# Altium project new_board.PrjPCB
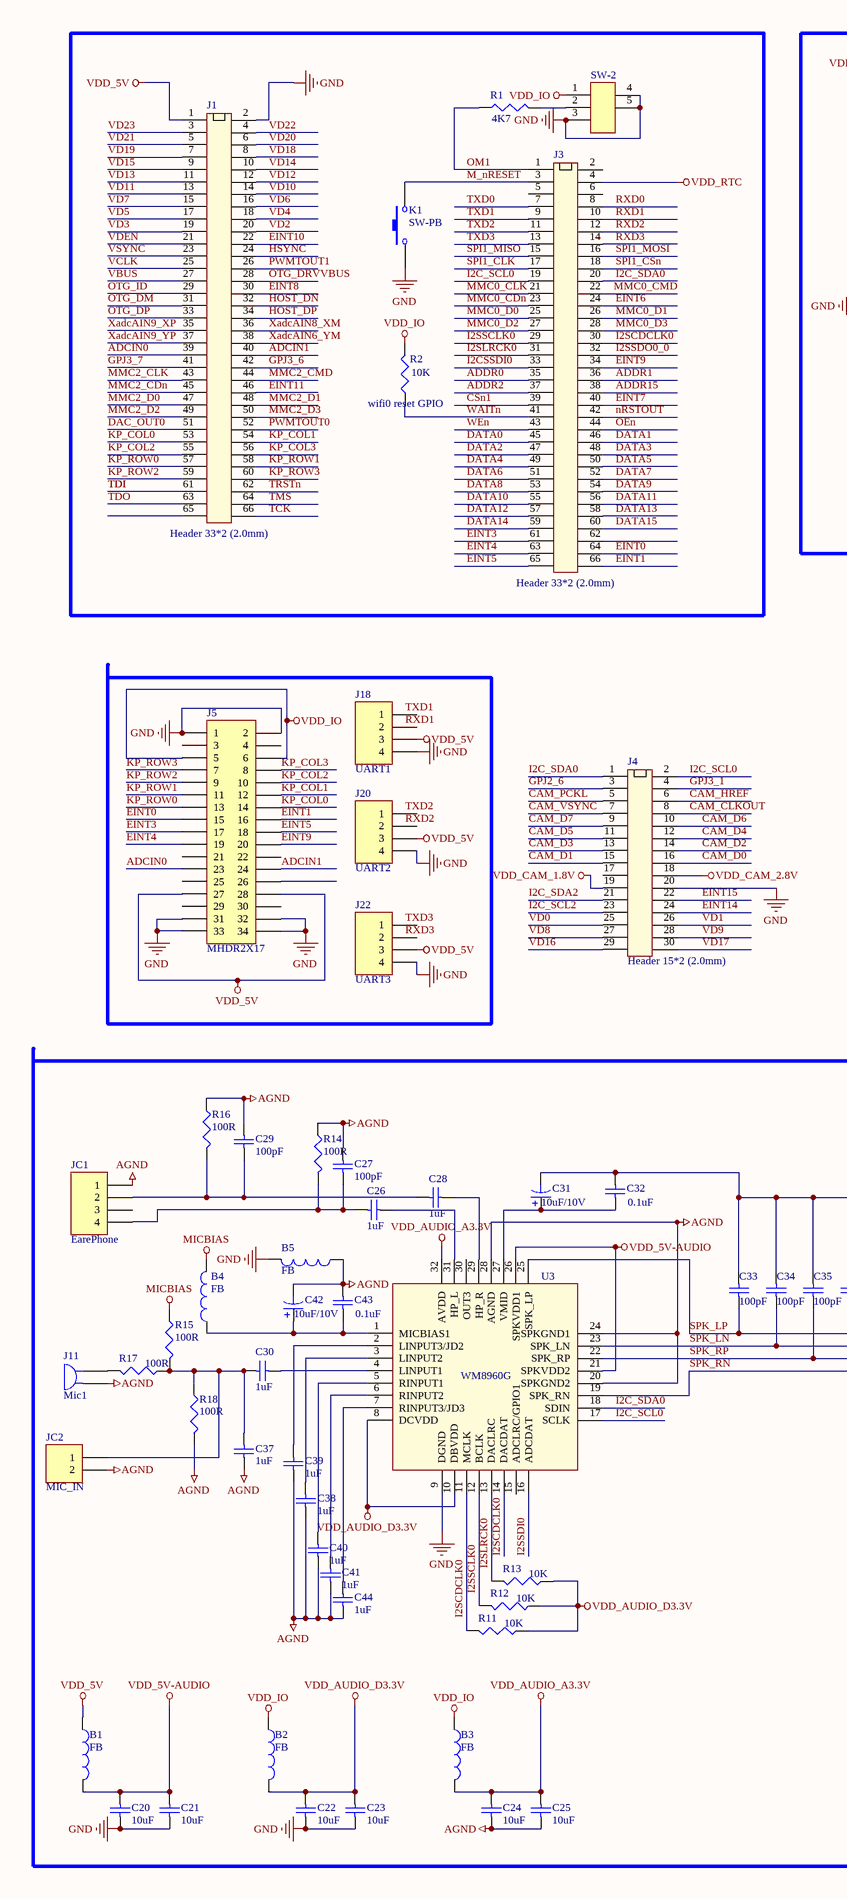
[diagram p0: new_board.SchDoc, left]
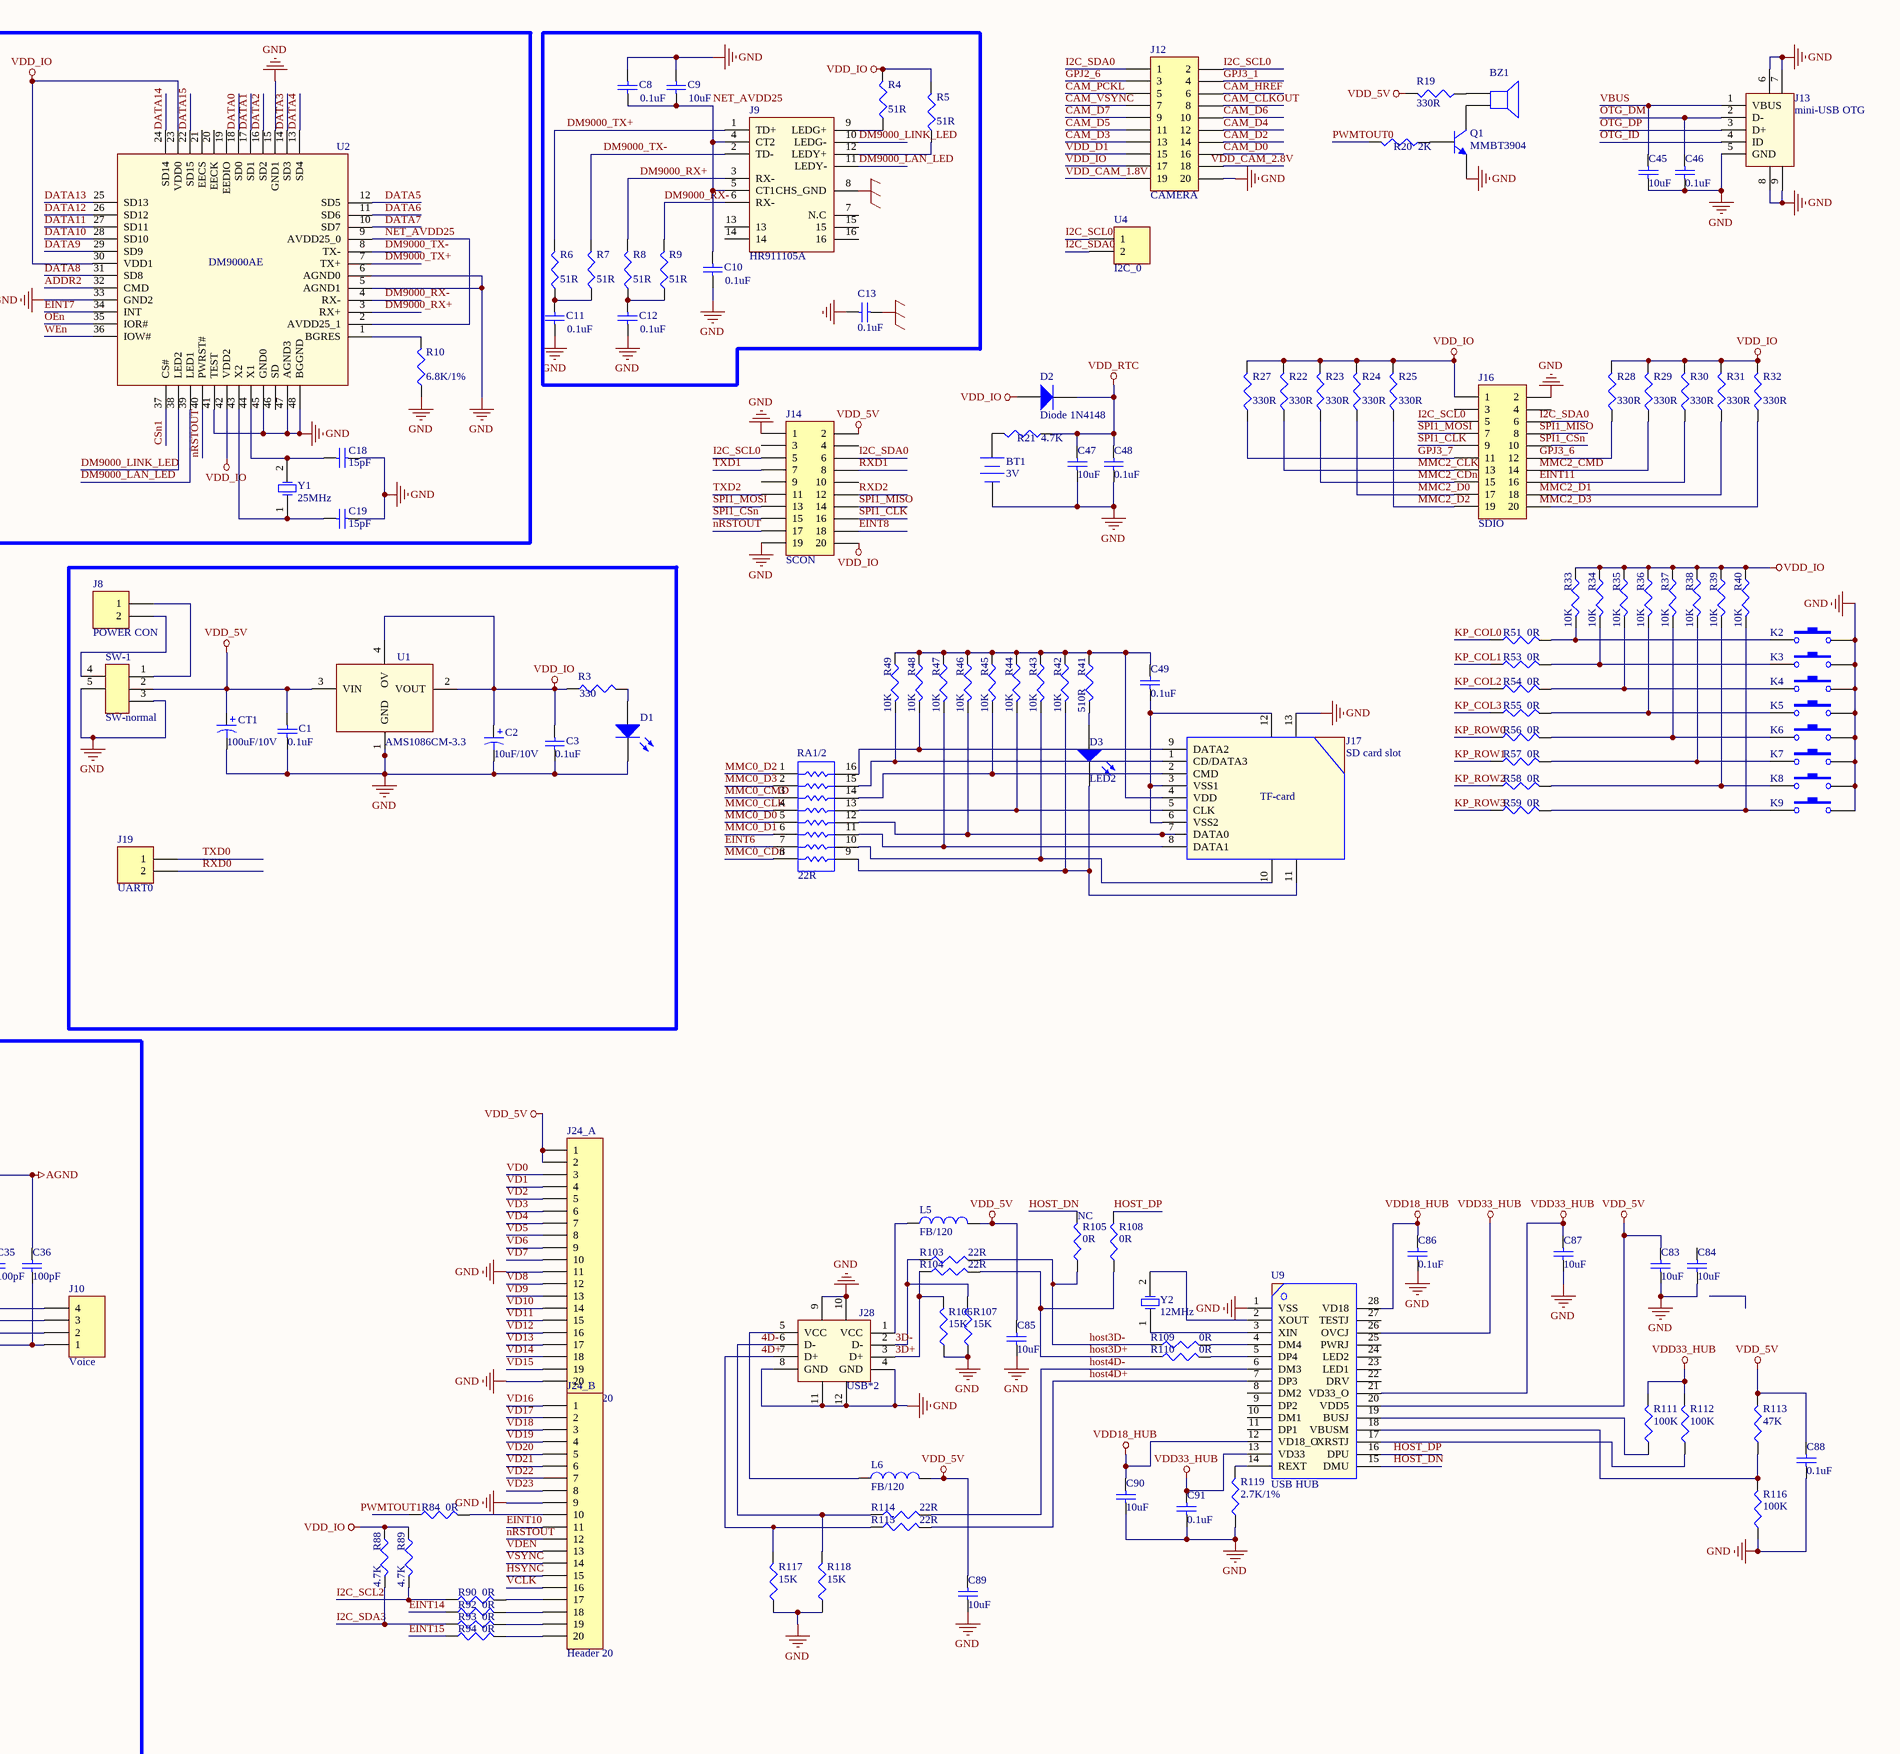
[diagram p1: new_board.SchDoc, right]
1 sheet, 185 parts. Net scope: global (net labels, ports and power ports of the same name join across sheets).
Board file: new_board.PcbDoc

## Sheet new_board.SchDoc
size A2

### Parts
B1  FB  [0603]
B2  FB  [0603]
B3  FB  [0603]
B4  FB  [0603]
B5  FB  [0603]
BT1  3V  [BAT-2]
BZ1  Speaker  [PIN2]  (value not drawn)
C1  value 0.1uF  [1608[0603]]  (hidden comment: Cap Semi)
C2  value 10uF/10V  [C0805]  (hidden comment: Cap Pol3)
C3  value 0.1uF  [1608[0603]]  (hidden comment: Cap Semi)
C8  value 0.1uF  [1608[0603]]  (hidden comment: Cap Semi)
C9  value 10uF  [1608[0603]]  (hidden comment: Cap Semi)
C10  value 0.1uF  [1608[0603]]  (hidden comment: Cap Semi)
C11  value 0.1uF  [1608[0603]]  (hidden comment: Cap Semi)
C12  value 0.1uF  [1608[0603]]  (hidden comment: Cap Semi)
C13  value 0.1uF  [1608[0603]]  (hidden comment: Cap Semi)
C18  value 15pF  [1608[0603]]  (hidden comment: Cap Semi)
C19  value 15pF  [1608[0603]]  (hidden comment: Cap Semi)
C20  value 10uF  [1608[0603]]  (hidden comment: Cap Semi)
C21  value 10uF  [1608[0603]]  (hidden comment: Cap Semi)
C22  value 10uF  [1608[0603]]  (hidden comment: Cap Semi)
C23  value 10uF  [1608[0603]]  (hidden comment: Cap Semi)
C24  value 10uF  [1608[0603]]  (hidden comment: Cap Semi)
C25  value 10uF  [1608[0603]]  (hidden comment: Cap Semi)
C26  value 1uF  [1608[0603]]  (hidden comment: Cap Semi)
C27  value 100pF  [1608[0603]]  (hidden comment: Cap Semi)
C28  value 1uF  [1608[0603]]  (hidden comment: Cap Semi)
C29  value 100pF  [1608[0603]]  (hidden comment: Cap Semi)
C30  value 1uF  [1608[0603]]  (hidden comment: Cap Semi)
C31  value 10uF/10V  [C0805]  (hidden comment: Cap Pol3)
C32  value 0.1uF  [1608[0603]]  (hidden comment: Cap Semi)
C33  value 100pF  [1608[0603]]  (hidden comment: Cap Semi)
C34  value 100pF  [1608[0603]]  (hidden comment: Cap Semi)
C35  value 100pF  [1608[0603]]  (hidden comment: Cap Semi)
C36  value 100pF  [1608[0603]]  (hidden comment: Cap Semi)
C37  value 1uF  [1608[0603]]  (hidden comment: Cap Semi)
C38  value 1uF  [1608[0603]]  (hidden comment: Cap Semi)
C39  value 1uF  [1608[0603]]  (hidden comment: Cap Semi)
C40  value 1uF  [1608[0603]]  (hidden comment: Cap Semi)
C41  value 1uF  [1608[0603]]  (hidden comment: Cap Semi)
C42  value 10uF/10V  [C0805]  (hidden comment: Cap Pol3)
C43  value 0.1uF  [1608[0603]]  (hidden comment: Cap Semi)
C44  value 1uF  [1608[0603]]  (hidden comment: Cap Semi)
C45  value 10uF  [1608[0603]]  (hidden comment: Cap Semi)
C46  value 0.1uF  [1608[0603]]  (hidden comment: Cap Semi)
C47  value 10uF  [1608[0603]]  (hidden comment: Cap Semi)
C48  value 0.1uF  [1608[0603]]  (hidden comment: Cap Semi)
C49  value 0.1uF  [1608[0603]]  (hidden comment: Cap Semi)
C83  value 10uF  [1608[0603]]  (hidden comment: Cap Semi)
C84  value 10uF  [1608[0603]]  (hidden comment: Cap Semi)
C85  value 10uF  [1608[0603]]  (hidden comment: Cap Semi)
C86  value 0.1uF  [1608[0603]]  (hidden comment: Cap Semi)
C87  value 10uF  [1608[0603]]  (hidden comment: Cap Semi)
C88  value 0.1uF  [1608[0603]]  (hidden comment: Cap Semi)
C89  value 10uF  [1608[0603]]  (hidden comment: Cap Semi)
C90  value 10uF  [1608[0603]]  (hidden comment: Cap Semi)
C91  value 0.1uF  [1608[0603]]  (hidden comment: Cap Semi)
CT1  value 100uF/10V  [C0805]  (hidden comment: Cap Pol3)
D1  LED1  [3.2X1.6X1.1]  (value not drawn)
D2  Diode 1N4148  [DO-35]
D3  LED2  [3.2X1.6X1.1]
J1  Header 33*2 (2.0mm)
J3  Header 33*2 (2.0mm)
J4  Header 15*2 (2.0mm)
J5  MHDR2X17  [MHDR2X17]
J8  POWER CON  [HDR1X2H]
J9  HR911105A
J10  Voice  [HDR1X4]
J11  Mic1  [PIN2]
J12  CAMERA  [HDR2X10]
J13  mini-USB OTG
J14  SCON  [HDR2X10]
J16  SDIO  [HDR2X10]
J17  SD card slot
J18  UART1  [MHDR1X4]
J19  UART0  [HDR1X2H]
J20  UART2  [MHDR1X4]
J22  UART3  [MHDR1X4]
J24_A  Header 20  [HDR1X20]
J24_B  Header 20  [HDR1X20]
J28  USB*2
JC1  EarePhone  [HDR1X4]
JC2  MIC_IN  [HDR1X2]
K1  SW-PB  [SPST-2]
K2  SW-PB  [SPST-2]  (value not drawn)
K3  SW-PB  [SPST-2]  (value not drawn)
K4  SW-PB  [SPST-2]  (value not drawn)
K5  SW-PB  [SPST-2]  (value not drawn)
K6  SW-PB  [SPST-2]  (value not drawn)
K7  SW-PB  [SPST-2]  (value not drawn)
K8  SW-PB  [SPST-2]  (value not drawn)
K9  SW-PB  [SPST-2]  (value not drawn)
L5  FB/120  [0603]
L6  FB/120  [0603]
Q1  MMBT3904  [SOT-23B_N]
R1  value 4K7  [J1-0603]  (hidden comment: Res3)
R2  value 10K  [J1-0603]  (hidden comment: Res3)
R3  value 330  [J1-0603]  (hidden comment: Res3)
R4  value 51R  [J1-0603]  (hidden comment: Res3)
R5  value 51R  [J1-0603]  (hidden comment: Res3)
R6  value 51R  [J1-0603]  (hidden comment: Res3)
R7  value 51R  [J1-0603]  (hidden comment: Res3)
R8  value 51R  [J1-0603]  (hidden comment: Res3)
R9  value 51R  [J1-0603]  (hidden comment: Res3)
R10  value 6.8K/1%  [J1-0603]  (hidden comment: Res3)
R11  value 10K  [J1-0603]  (hidden comment: Res3)
R12  value 10K  [J1-0603]  (hidden comment: Res3)
R13  value 10K  [J1-0603]  (hidden comment: Res3)
R14  value 100R  [J1-0603]  (hidden comment: Res3)
R15  value 100R  [J1-0603]  (hidden comment: Res3)
R16  value 100R  [J1-0603]  (hidden comment: Res3)
R17  value 100R  [J1-0603]  (hidden comment: Res3)
R18  value 100R  [J1-0603]  (hidden comment: Res3)
R19  value 330R  [J1-0603]  (hidden comment: Res3)
R20  value 2K  [J1-0603]  (hidden comment: Res3)
R21  value 4.7K  [J1-0603]  (hidden comment: Res3)
R22  value 330R  [J1-0603]  (hidden comment: Res3)
R23  value 330R  [J1-0603]  (hidden comment: Res3)
R24  value 330R  [J1-0603]  (hidden comment: Res3)
R25  value 330R  [J1-0603]  (hidden comment: Res3)
R27  value 330R  [J1-0603]  (hidden comment: Res3)
R28  value 330R  [J1-0603]  (hidden comment: Res3)
R29  value 330R  [J1-0603]  (hidden comment: Res3)
R30  value 330R  [J1-0603]  (hidden comment: Res3)
R31  value 330R  [J1-0603]  (hidden comment: Res3)
R32  value 330R  [J1-0603]  (hidden comment: Res3)
R33  value 10K  [J1-0603]  (hidden comment: Res3)
R34  value 10K  [J1-0603]  (hidden comment: Res3)
R35  value 10K  [J1-0603]  (hidden comment: Res3)
R36  value 10K  [J1-0603]  (hidden comment: Res3)
R37  value 10K  [J1-0603]  (hidden comment: Res3)
R38  value 10K  [J1-0603]  (hidden comment: Res3)
R39  value 10K  [J1-0603]  (hidden comment: Res3)
R40  value 10K  [J1-0603]  (hidden comment: Res3)
R41  value 510R  [J1-0603]  (hidden comment: Res3)
R42  value 10K  [J1-0603]  (hidden comment: Res3)
R43  value 10K  [J1-0603]  (hidden comment: Res3)
R44  value 10K  [J1-0603]  (hidden comment: Res3)
R45  value 10K  [J1-0603]  (hidden comment: Res3)
R46  value 10K  [J1-0603]  (hidden comment: Res3)
R47  value 10K  [J1-0603]  (hidden comment: Res3)
R48  value 10K  [J1-0603]  (hidden comment: Res3)
R49  value 10K  [J1-0603]  (hidden comment: Res3)
R51  value 0R  [J1-0603]  (hidden comment: Res3)
R53  value 0R  [J1-0603]  (hidden comment: Res3)
R54  value 0R  [J1-0603]  (hidden comment: Res3)
R55  value 0R  [J1-0603]  (hidden comment: Res3)
R56  value 0R  [J1-0603]  (hidden comment: Res3)
R57  value 0R  [J1-0603]  (hidden comment: Res3)
R58  value 0R  [J1-0603]  (hidden comment: Res3)
R59  value 0R  [J1-0603]  (hidden comment: Res3)
R84  value 0R  [J1-0603]  (hidden comment: Res3)
R88  value 4.7K  [J1-0603]  (hidden comment: Res3)
R89  value 4.7K  [J1-0603]  (hidden comment: Res3)
R90  value 0R  [J1-0603]  (hidden comment: Res3)
R92  value 0R  [J1-0603]  (hidden comment: Res3)
R93  value 0R  [J1-0603]  (hidden comment: Res3)
R94  value 0R  [J1-0603]  (hidden comment: Res3)
R103  value 22R  [J1-0603]  (hidden comment: Res3)
R104  value 22R  [J1-0603]  (hidden comment: Res3)
R105  NC  value 0R  [J1-0603]
R106  value 15K  [J1-0603]  (hidden comment: Res3)
R107  value 15K  [J1-0603]  (hidden comment: Res3)
R108  value 0R  [J1-0603]  (hidden comment: Res3)
R109  value 0R  [J1-0603]  (hidden comment: Res3)
R110  value 0R  [J1-0603]  (hidden comment: Res3)
R111  value 100K  [J1-0603]  (hidden comment: Res3)
R112  value 100K  [J1-0603]  (hidden comment: Res3)
R113  value 47K  [J1-0603]  (hidden comment: Res3)
R114  value 22R  [J1-0603]  (hidden comment: Res3)
R115  value 22R  [J1-0603]  (hidden comment: Res3)
R116  value 100K  [J1-0603]  (hidden comment: Res3)
R117  value 15K  [J1-0603]  (hidden comment: Res3)
R118  value 15K  [J1-0603]  (hidden comment: Res3)
R119  value 2.7K/1%  [J1-0603]  (hidden comment: Res3)
RA1/2  value 22R  [SO-16_N]  (hidden comment: Res Pack3)
SW-1  SW-normal
SW-2  SW-normal  (value not drawn)
U1  AMS1086CM-3.3
U2  DM9000AE  (value not drawn)
U3  WM8960GEFL  (value not drawn)
U4  I2C_0  [HDR1X2]
U9  USB HUB
Y1  25MHz  [R38]
Y2  12MHz  [R38]

### Blocks framed on the sheet
wifi0 reset GPIO: J1 J3 K1 R1 R2 SW-2

### Nets
AGND: B5.1 C24.1 C25.1 C27.1 C29.1 C31.2 C32.2 C33.2 C34.2 C35.2 C36.2 C37.1 C38.1 C39.1 C40.1 C41.1 C42.2 C43.2 C44.1 J11.1 JC1.1 JC2.2 R14.1 R16.1 R18.2 U3.20(SPKGND2) U3.24(SPKGND1) U3.28(AGND)
GND: B5.2 BT1.2(-) C1.1 C2.2 C3.1 C8.1 C9.1 C10.2 C11.2 C12.2 C13.1 C13.2 C18.2 C19.2 C20.1 C21.1 C22.1 C23.1 C45.2 C46.2 C47.2 C48.2 C83.2 C84.2 C85.2 C86.2 C87.2 C88.2 C89.2 C90.2 C91.2 CT1.2 D1.2(K) J1.2 J4.20 J5.1 J5.2 J5.31 J5.32 J5.33 J5.34 J9.8(CHS_GND) J12.20 J13.5(GND) J13.6 J13.7 J13.8 J13.9 J14.1 J14.19 J16.2 J17.13 J18.4 J20.4 J22.4 J24_A.11 J24_A.20 J24_B.9 J28.4(GND) J28.8(GND) J28.9 J28.10 J28.11 J28.12 K1.1 K2.2 K3.2 K4.2 K5.2 K6.2 K7.2 K8.2 K9.2 Q1.3(E) R10.1 R106.1 R107.1 R116.1 R117.1 R118.1 R119.1 SW-1.3 SW-1.5 SW-2.3 SW-2.4 SW-2.5 U1.1(GND) U2.5(AGND1) U2.6(AGND0) U2.15(GND1) U2.33(GND2) U2.41(TEST) U2.45(GND0) U2.47(AGND3) U2.48(BGGND) U3.9(DGND) U9.1(VSS)
MICBIAS: B4.2 R15.1
VDD18_HUB: C86.1 C90.1 U9.12(VD18_O) U9.28(VD18)
VDD33_HUB: C87.1 C91.1 R111.2 R112.2 U9.13(VD33) U9.21(VD33_O) U9.26(OVCJ)
VDD_5V: B1.1 C1.2 C83.1 C85.1 C88.1 C89.1 CT1.1 J1.1 J5.27 J5.28 J14.2 J18.3 J20.3 J22.3 J24_A.1 J24_A.2 L5.2 L6.2 R19.2 R113.2 SW-1.2 U1.3(VIN) U9.20(VDD5)
VDD_5V-AUDIO: B1.2 C20.2 C21.2 U3.21(SPKVDD2) U3.26(SPKVDD1)
VDD_AUDIO_A3.3V: B3.2 C24.2 C25.2 U3.32(AVDD)
VDD_AUDIO_D3.3V: B2.2 C22.2 C23.2 R11.1 R12.1 R13.1 U3.8(DCVDD) U3.10(DBVDD)
VDD_CAM_1.8V: J4.19 J12.19
VDD_CAM_2.8V: J4.18
VDD_IO: B2.1 B3.1 C2.1 C3.2 D2.1(A) J5.5 J5.6 J12.17 J14.20 J16.1 R2.2 R3.1 R4.2 R5.2 R22.2 R23.2 R24.2 R25.2 R27.2 R28.2 R29.2 R30.2 R31.2 R32.2 R33.1 R34.1 R35.1 R36.1 R37.1 R38.1 R39.1 R40.1 R88.1 R89.1 SW-2.1 U1.2(VOUT) U1.4(OV) U2.23(VDD0) U2.30(VDD1) U2.42(VDD2)
VDD_RTC: C47.1 C48.1 D2.2(K) J3.4 R21.1
3D+: J28.3(D+) R104.1 R106.2
3D-: J28.2(D-) R103.1 R107.2
4D+: J28.7(D+) R115.1 R117.2
4D-: J28.6(D-) R114.1 R118.2
ADCIN0: J1.39 J5.23
ADCIN1: J1.40 J5.24
ADDR0: J3.35
ADDR1: J3.36
ADDR2: J3.37 U2.32(CMD)
ADDR15: J3.38
CAM_CLKOUT: J4.8 J12.8
CAM_D0: J4.16 J12.16
CAM_D1: J4.15
CAM_D2: J4.14 J12.14
CAM_D3: J4.13 J12.13
CAM_D4: J4.12 J12.12
CAM_D5: J4.11 J12.11
CAM_D6: J4.10 J12.10
CAM_D7: J4.9 J12.9
CAM_HREF: J4.6 J12.6
CAM_PCKL: J4.5 J12.5
CAM_VSYNC: J4.7 J12.7
CSn1: J3.39 U2.37(CS#)
DAC_OUT0: J1.51
DATA0: J3.45 U2.18(SD0)
DATA1: J3.46 U2.17(SD1)
DATA2: J3.47 U2.16(SD2)
DATA3: J3.48 U2.14(SD3)
DATA4: J3.49 U2.13(SD4)
DATA5: J3.50 U2.12(SD5)
DATA6: J3.51 U2.11(SD6)
DATA7: J3.52 U2.10(SD7)
DATA8: J3.53 U2.31(SD8)
DATA9: J3.54 U2.29(SD9)
DATA10: J3.55 U2.28(SD10)
DATA11: J3.56 U2.27(SD11)
DATA12: J3.57 U2.26(SD12)
DATA13: J3.58 U2.25(SD13)
DATA14: J3.59 U2.24(SD14)
DATA15: J3.60 U2.22(SD15)
DM9000_LAN_LED: J9.11(LEDY-) U2.39(LED1)
DM9000_LINK_LED: J9.10(LEDG-) U2.38(LED2)
DM9000_RX+: J9.3(RX-) R8.2 U2.3(RX+)
DM9000_RX-: J9.6(RX-) R9.2 U2.4(RX-)
DM9000_TX+: J9.1(TD+) R6.2 U2.7(TX+)
DM9000_TX-: J9.2(TD-) R7.2 U2.8(TX-)
EINT0: J3.64 J5.15
EINT1: J3.66 J5.16
EINT3: J3.61 J5.17
EINT4: J3.63 J5.19
EINT5: J3.65 J5.18
EINT6: J3.24 RA1/2.7
EINT7: J3.40 U2.34(INT)
EINT8: J1.30 J14.18
EINT9: J3.34 J5.20
EINT10: J1.22 J24_B.11
EINT11: J1.46
EINT14: J4.24 R92.1
EINT15: J4.22 R94.1
GPJ2_6: J4.3 J12.3
GPJ3_1: J4.4 J12.4
GPJ3_6: J1.42
GPJ3_7: J1.41 J16.11 R27.1
host3D+: R104.2 R108.1 R110.1
host3D-: R103.2 R105.1 R109.1
host4D+: R115.2 U9.7(DP3)
host4D-: R114.2 U9.6(DM3)
HOST_DN: J1.32 R105.2 U9.15(DMU)
HOST_DP: J1.34 R108.2 U9.16(DPU)
HSYNC: J1.24 J24_B.15
I2C_SCL0: J3.19 J4.2 J12.2 J14.5 J16.5 U3.17(SCLK) U4.1
I2C_SCL2: J4.23 R89.2 R90.1
I2C_SDA0: J3.20 J4.1 J12.1 J14.6 U3.18(SDIN) U4.2
I2C_SDA2: J4.21
I2C_SDA3: R88.2 R93.1
I2CSSDI0: J3.33
I2SCDCLK0: J3.30 R11.2 U3.11(MCLK) U3.14(DACDAT)
I2SLRCK0: J3.31 R13.2 U3.13(DACLRC)
I2SSCLK0: J3.29 R12.2 U3.12(BCLK)
I2SSDI0: U3.16(ADCDAT)
I2SSDO0_0: J3.32
KP_COL0: J1.53 J5.14 R51.1
KP_COL1: J1.54 J5.12 R53.1
KP_COL2: J1.55 J5.10 R54.1
KP_COL3: J1.56 J5.8 R55.1
KP_ROW0: J1.57 J5.13 R56.1
KP_ROW1: J1.58 J5.11 R57.1
KP_ROW2: J1.59 J5.9 R58.1
KP_ROW3: J1.60 J5.7 R59.1
M_nRESET: J3.3 K1.2
MMC0_CDn: J3.23 RA1/2.8
MMC0_CLK: J3.21 RA1/2.4
MMC0_CMD: J3.22 RA1/2.3
MMC0_D0: J3.25 RA1/2.5
MMC0_D1: J3.26 RA1/2.6
MMC0_D2: J3.27 RA1/2.1
MMC0_D3: J3.28 RA1/2.2
MMC2_CDn: J1.45 J16.15 R23.1
MMC2_CLK: J1.43 J16.13 R22.1
MMC2_CMD: J1.44
MMC2_D0: J1.47 J16.17 R24.1
MMC2_D1: J1.48
MMC2_D2: J1.49 J16.19 R25.1
MMC2_D3: J1.50
NET_AVDD25: C8.2 C9.2 C10.1 J9.4(CT2) J9.5(CT1) U2.2(AVDD25_1) U2.9(AVDD25_0)
nRSTOUT: J3.42 J14.17 J24_B.12 U2.40(PWRST#)
OEn: J3.44 U2.35(IOR#)
OM1: J3.1 R1.1
OTG_DM: C46.1 J1.31 J13.2(D-)
OTG_DP: J1.33 J13.3(D+)
OTG_DRVVBUS: J1.28
OTG_ID: J1.29 J13.4(ID)
PWMTOUT0: J1.52 R20.2
PWMTOUT1: J1.26
RXD0: J3.8 J19.2
RXD1: J3.10 J14.8
RXD2: J3.12 J14.12
RXD3: J3.14
SPI1_CLK: J3.17 J14.16 J16.9
SPI1_CSn: J3.18 J14.15
SPI1_MISO: J3.15 J14.14
SPI1_MOSI: J3.16 J14.13 J16.7
SPK_LN: C34.1 J10.3 U3.23(SPK_LN)
SPK_LP: C33.1 J10.4 U3.25(SPK_LP)
SPK_RN: C36.1 J10.1 U3.19(SPK_RN)
SPK_RP: C35.1 J10.2 U3.22(SPK_RP)
TCK: J1.66
TDI: J1.61
TDO: J1.63
TMS: J1.64
TRSTn: J1.62
TXD0: J3.7 J19.1
TXD1: J3.9 J14.7
TXD2: J3.11 J14.11
TXD3: J3.13
VBUS: C45.1 J1.27 J13.1(VBUS)
VCLK: J1.25 J24_B.16
VD0: J4.25 J24_A.3
VD1: J4.26 J24_A.4
VD2: J1.20 J24_A.5
VD3: J1.19 J24_A.6
VD4: J1.18 J24_A.7
VD5: J1.17 J24_A.8
VD6: J1.16 J24_A.9
VD7: J1.15 J24_A.10
VD8: J4.27 J24_A.12
VD9: J4.28 J24_A.13
VD10: J1.14 J24_A.14
VD11: J1.13 J24_A.15
VD12: J1.12 J24_A.16
VD13: J1.11 J24_A.17
VD14: J1.10 J24_A.18
VD15: J1.9 J24_A.19
VD16: J4.29 J24_B.1
VD17: J4.30 J24_B.2
VD18: J1.8 J24_B.3
VD19: J1.7 J24_B.4
VD20: J1.6 J24_B.5
VD21: J1.5 J24_B.6
VD22: J1.4 J24_B.7
VD23: J1.3 J24_B.8
VDD_D1: J12.15
VDEN: J1.21 J24_B.13
VSYNC: J1.23 J24_B.14
WAITn: J3.41 R2.1
WEn: J3.43 U2.36(IOW#)
XadcAIN6_YM: J1.38
XadcAIN8_XM: J1.36
XadcAIN9_XP: J1.35
XadcAIN9_YP: J1.37
NetB4_1: B4.1 C42.1 C43.1 U3.1(MICBIAS1)
NetBT1_1: BT1.1(+) R21.2
NetBZ1_1: BZ1.1 R19.1
NetBZ1_2: BZ1.2 Q1.1(C)
NetC11_1: C11.1 R6.1 R7.1
NetC12_1: C12.1 R8.1 R9.1
NetC18_1: C18.1 U2.44(X1) Y1.2(OSC2)
NetC19_1: C19.1 U2.43(X2) Y1.1(OSC1)
NetC26_1: C26.1 U3.31(HP_L)
NetC26_2: C26.2 C27.2 JC1.4 R14.2
NetC28_1: C28.1 U3.29(HP_R)
NetC28_2: C28.2 C29.2 JC1.2 R16.2
NetC30_1: C30.1 U3.4(LINPUT1)
NetC30_2: C30.2 C37.2 JC2.1 R15.2 R17.1 R18.1
NetC31_1: C31.1 C32.1 U3.27(VMID)
NetC38_2: C38.2 U3.3(LINPUT2)
NetC39_2: C39.2 U3.2(LINPUT3/JD2)
NetC40_2: C40.2 U3.5(RINPUT1)
NetC41_2: C41.2 U3.6(RINPUT2)
NetC44_2: C44.2 U3.7(RINPUT3/JD3)
NetC49_1: C49.1 J17.4(VDD) R41.1 R42.1 R43.1 R44.1 R45.1 R46.1 R47.1 R48.1 R49.1
NetC49_2: C49.2 J17.3(VSS1) J17.6(VSS2) J17.12
NetD1_1: D1.1(A) R3.2
NetD3_1: D3.1(A) R41.2
NetD3_2: D3.2(K) J17.11 R42.2 RA1/2.9
NetJ8_1: J8.1 SW-1.1
NetJ8_2: J8.2 SW-1.4
NetJ9_9: J9.9(LEDG+) R4.1
NetJ9_12: J9.12(LEDY+) R5.1
NetJ11_2: J11.2 R17.2
NetJ16_12: J16.12 R28.1
NetJ16_14: J16.14 R29.1
NetJ16_16: J16.16 R30.1
NetJ16_18: J16.18 R31.1
NetJ16_20: J16.20 R32.1
NetJ17_1: J17.1(CD/DATA3) R49.2 RA1/2.15
NetJ17_2: J17.2(CMD) R45.2 RA1/2.14
NetJ17_5: J17.5(CLK) R44.2 RA1/2.13
NetJ17_7: J17.7(DATA0) R46.2 RA1/2.12
NetJ17_8: J17.8(DATA1) R47.2 RA1/2.11
NetJ17_9: J17.9(DATA2) R48.2 RA1/2.16
NetJ17_10: J17.10 R43.2 RA1/2.10
NetJ24_B_10: J24_B.10 R84.2
NetJ24_B_17: J24_B.17 R90.2
NetJ24_B_18: J24_B.18 R92.2
NetJ24_B_19: J24_B.19 R93.2
NetJ24_B_20: J24_B.20 R94.2
NetJ28_1: J28.1(VCC) L5.1
NetJ28_5: J28.5(VCC) L6.1
NetK2_1: K2.1 R33.2 R51.2
NetK3_1: K3.1 R34.2 R53.2
NetK4_1: K4.1 R35.2 R54.2
NetK5_1: K5.1 R36.2 R55.2
NetK6_1: K6.1 R37.2 R56.2
NetK7_1: K7.1 R38.2 R57.2
NetK8_1: K8.1 R39.2 R58.2
NetK9_1: K9.1 R40.2 R59.2
NetQ1_2: Q1.2(B) R20.1
NetR1_2: R1.2 SW-2.2
NetR10_2: R10.2 U2.1(BGRES)
NetR109_2: R109.2 U9.4(DM4)
NetR110_2: R110.2 U9.5(DP4)
NetR111_1: R111.1 U9.19(BUSJ)
NetR112_1: R112.1 U9.17(XRSTJ)
NetR113_1: R113.1 R116.2 U9.18(VBUSM)
NetR119_2: R119.2 U9.14(REXT)
NetU9_2: U9.2(XOUT) Y2.2(OSC2)
NetU9_3: U9.3(XIN) Y2.1(OSC1)

Not connected (* = marked no-connect by the designer): C84 1; J1 65; J3 2 5 6 62; J4 17; J5 3 4 21 22 25 26 29 30; J9 7(N.C) 13 14 15 16; J12 18; J14 3 4 9 10; J16 3 4 6 8 10; J18 1 2; J20 1 2; J22 1 2; JC1 3; R84 1; U2 19(EEDIO) 20(EECK) 21(EECS) 46(SD); U3 15(ADCLRC/GPIO1) 30(OUT3); U9 8(DM2) 9(DP2) 10(DM1) 11(DP1) 22(DRV) 23(LED1) 24(LED2) 25(PWRJ) 27(TESTJ)

### Notes on the sheet
- Labels drawn without touching a wire or pin: EINT11, GPJ3_6, I2C_SDA0, MMC2_CMD, MMC2_D1, MMC2_D3, PWMTOUT1, RXD1, RXD2, RXD3, SPI1_CSn, SPI1_MISO, TXD1, TXD2, TXD3, VDD_CAM_2.8V
- (in symbol SD card slot) TF-card
- (in symbol WM8960GEFL) WM8960G

### Library data of the parts
B1-B5 L5 L6 = Inductor: Code_IEC: 1005; Value: 10mH; Published: 8-Jun-2000; LatestRevisionDate: 29-May-2009; LatestRevisionNote: IPC-7351 Footprint Added.; PackageReference: 0402-A; Publisher: Altium Limited; PackageDescription: Chip Inductor; Code_JEITA: 0402
BT1 = Battery: Multicell Battery; Published: 24-Mar-1999; LatestRevisionDate: 17-Jul-2002; LatestRevisionNote: Re-released for DXP Platform.; PackageReference: BAT-2; Publisher: Altium Limited; PackageDescription: Battery; 2 Leads
BZ1 = Speaker: Loudspeaker; Published: 24-Mar-1999; LatestRevisionDate: 17-Jul-2002; LatestRevisionNote: Re-released for DXP Platform.; PackageReference: PIN2; Publisher: Altium Limited
C1 C3 C8-C13 C18-C30 C32-C41 C43-C49 C83-C91 = Cap Semi: Capacitor (Semiconductor SIM Model); Published: 8-Jun-2000; LatestRevisionDate: 29-May-2009; LatestRevisionNote: IPC-7351 Footprint Added.; PackageReference: C1206; Publisher: Altium Limited; PackageDescription: Chip Capacitor
C2 C31 C42 CT1 = Cap Pol3: Polarized Capacitor (Surface Mount); Published: 8-Jun-2000; LatestRevisionDate: 29-May-2009; LatestRevisionNote: IPC-7351 Footprint Added.; PackageReference: C0805; Publisher: Altium Limited; PackageDescription: Chip Capacitor
D1 D3 = LED2: Typical RED, GREEN, YELLOW, AMBER GaAs LED; Published: 8-Jun-2000; LatestRevisionDate: 17-Jul-2002; LatestRevisionNote: Re-released for DXP Platform.; PackageVersion: Feb-2002; PackageReference: 3.2X1.6X1.1; Publisher: Altium Limited; PackageDescription: SM LED; 2 Flat Leads
D2 = Diode 1N4148: High Conductance Fast Diode; Published: 8-Jun-2000; LatestRevisionDate: 17-Jul-2002; LatestRevisionNote: Re-released for DXP Platform.; DatasheetVersion: 1997; PackageReference: DO-35; Publisher: Altium Limited; PackageDescription: Diode, Axial; Body 3.8 x 1.9 mm (LxDia. max), Lead Dia. 0.53 mm (max); Code_JEDEC: DO-204-AH; ComponentLink1Description: Manufacturer Link; ComponentLink1URL: http://www.fairchildsemi.com/; ComponentLink2Description: Datasheet; ComponentLink2URL: http://www.fairchildsemi.com/ds/1N%2F1N4148.pdf
J5 = MHDR2X17: Header, 17-Pin, Dual row; LatestRevisionDate: 17-Jul-2002; LatestRevisionNote: Re-released for DXP Platform.; Publisher: Altium Limited
J8 J19 = Header 2H: Header, 2-Pin, Right Angle; LatestRevisionDate: 17-Jul-2002; LatestRevisionNote: Re-released for DXP Platform.; Publisher: Altium Limited
J9 = HR911105A: 100M net connector
J10 JC1 = Header 4: Header, 4-Pin; LatestRevisionDate: 17-Jul-2002; LatestRevisionNote: Re-released for DXP Platform.; Publisher: Altium Limited
J11 = Mic1: Microphone; Published: 24-Mar-1999; LatestRevisionDate: 17-Jul-2002; LatestRevisionNote: Re-released for DXP Platform.; PackageReference: PIN2; Publisher: Altium Limited
J12 J14 J16 = Header 10X2: Header, 10-Pin, Dual row; LatestRevisionDate: 17-Jul-2002; LatestRevisionNote: Re-released for DXP Platform.; Publisher: Altium Limited
J18 J20 J22 = MHDR1X4: Header, 4-Pin; LatestRevisionDate: 17-Jul-2002; LatestRevisionNote: Re-released for DXP Platform.; Publisher: Altium Limited
J24_A J24_B = Header 20: Header, 20-Pin; LatestRevisionDate: 17-Jul-2002; LatestRevisionNote: Re-released for DXP Platform.; Publisher: Altium Limited
JC2 U4 = Header 2: Header, 2-Pin; LatestRevisionDate: 17-Jul-2002; LatestRevisionNote: Re-released for DXP Platform.; Publisher: Altium Limited
K1-K9 = SW-PB: Switch; Published: 24-Mar-1999; LatestRevisionDate: 17-Jul-2002; LatestRevisionNote: Re-released for DXP Platform.; PackageReference: SPST-2; Publisher: Altium Limited; PackageDescription: Switch; 2 Leads
Q1 = QNPN: NPN Bipolar Transistor; Published: 8-Jun-2000; LatestRevisionDate: 29-May-2009; LatestRevisionNote: IPC-7351 Footprint Added.; PackageVersion: Aug-1999; PackageReference: SOT-23B; Publisher: Altium Limited; PackageDescription: 3-Pin SOT-23 Package 0.95 mm Pitch, 2.4 mm Lead Span
R1-R25 R27-R49 R51 R53-R59 R84 R88-R90 R92-R94 R103-R119 = Res3: Resistor; Published: 8-Jun-2000; LatestRevisionDate: 29-May-2009; LatestRevisionNote: IPC-7351 Footprint Added.; PackageReference: J1-0603; Publisher: Altium Limited; PackageDescription: Chip Resistor
RA1/2 = Res Pack3: Isolated Resistor Network; Published: 24-Mar-1999; LatestRevisionDate: 29-May-2009; LatestRevisionNote: IPC-7351 Footprint Added.; PackageReference: SO-16; Publisher: Altium Limited; PackageDescription: 16-Pin Small Outline Integrated Circuit 1.27 mm Pitch; Code_JEDEC: MS-012-AC; Code_IPC: SOIC127P600-16
U9 = USB HUB IC
Y1 Y2 = XTAL: Crystal Oscillator; Published: 8-Jun-2000; LatestRevisionDate: 17-Jul-2002; LatestRevisionNote: Re-released for DXP Platform.; PackageReference: R38; Publisher: Altium Limited; PackageDescription: Crystal, Thru-Hole; 2 Leads; Body 3.1 x 8.2 mm (Dia.xH)